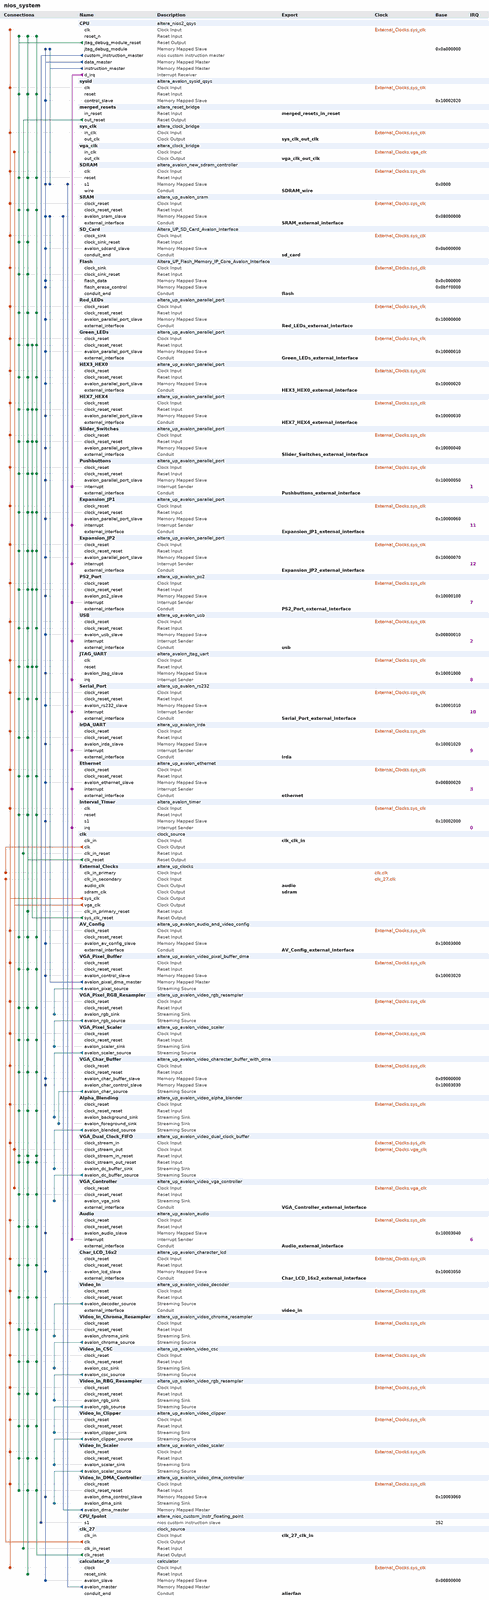
[diagram p0: system contents, whole]
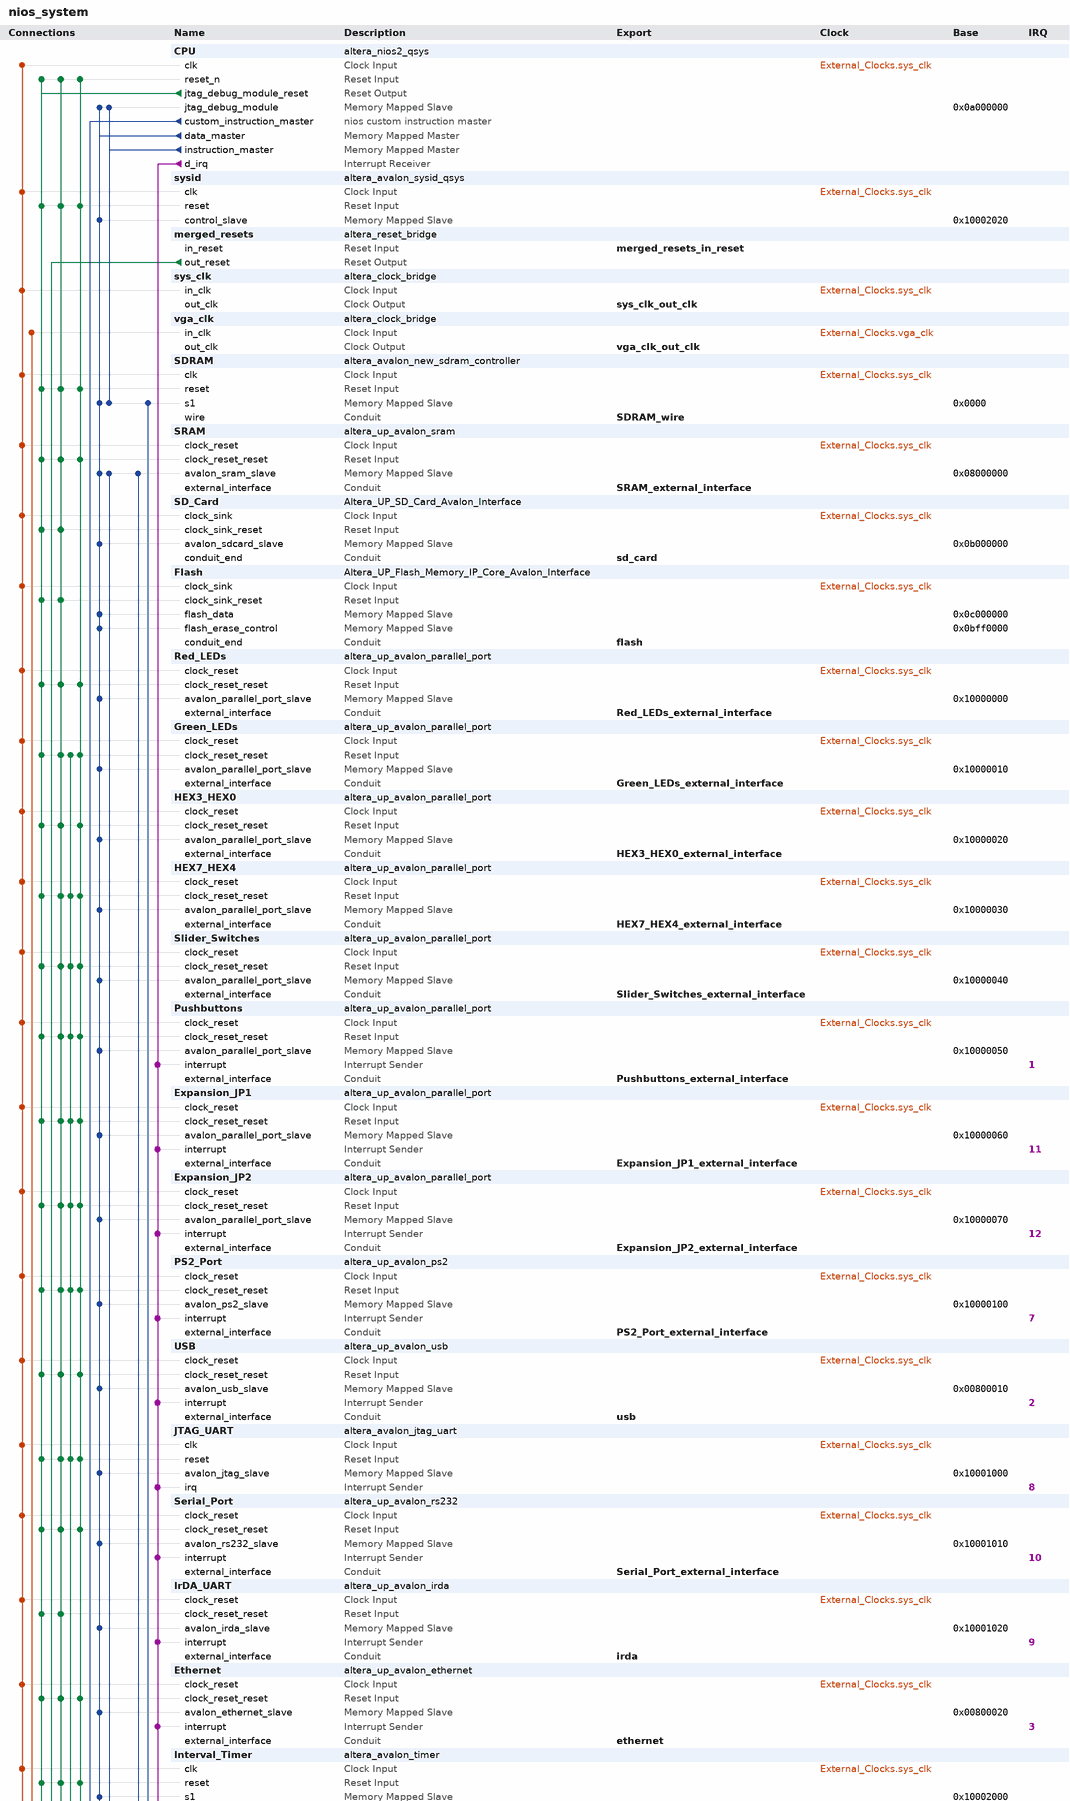
[diagram p1: system contents, upper part]
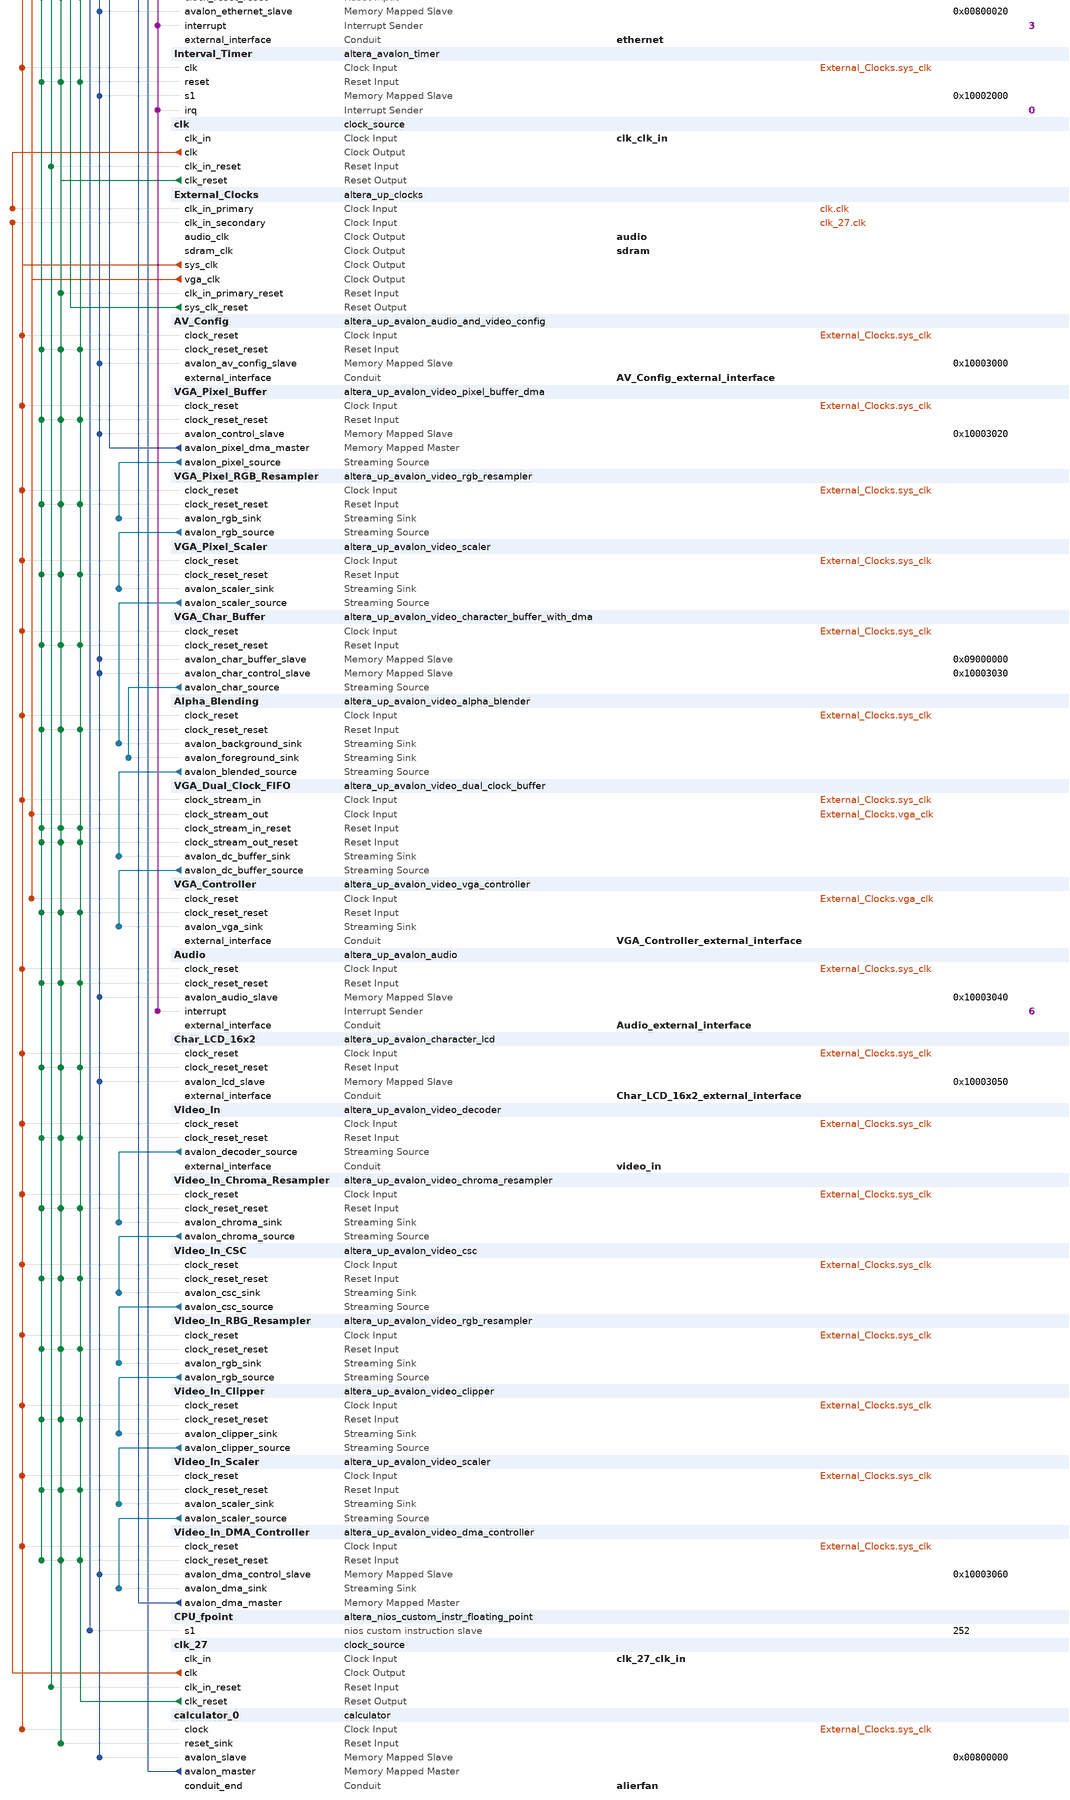
[diagram p2: system contents, lower part]
# Platform Designer (Qsys) system nios_system, Cyclone II EP2C35F672C6
# Parameters at their usual value, and those the tool derives, are not listed.
package require -exact qsys 13.0
create_system nios_system
set_project_property DEVICE_FAMILY {Cyclone II}
set_project_property DEVICE EP2C35F672C6

add_instance CPU altera_nios2_qsys 13.0
set_instance_parameter_value CPU muldiv_divider true
set_instance_parameter_value CPU resetSlave SDRAM.s1
set_instance_parameter_value CPU exceptionSlave SDRAM.s1
set_instance_parameter_value CPU breakSlave CPU.jtag_debug_module
set_instance_parameter_value CPU mmu_processIDNumBits 10
set_instance_parameter_value CPU impl Fast
set_instance_parameter_value CPU icache_size 4096
set_instance_parameter_value CPU debug_level Level3
set_instance_parameter_value CPU dcache_size 0
set_instance_parameter_value CPU dcache_lineSize 4

add_instance sysid altera_avalon_sysid_qsys 13.0
set_instance_parameter_value sysid id 0

add_instance merged_resets altera_reset_bridge 13.0
set_instance_parameter_value merged_resets ACTIVE_LOW_RESET 1
set_instance_parameter_value merged_resets SYNCHRONOUS_EDGES none

add_instance sys_clk altera_clock_bridge 13.0
set_instance_parameter_value sys_clk DERIVED_CLOCK_RATE 50000000
set_instance_parameter_value sys_clk EXPLICIT_CLOCK_RATE 0

add_instance vga_clk altera_clock_bridge 13.0
set_instance_parameter_value vga_clk DERIVED_CLOCK_RATE 25000000
set_instance_parameter_value vga_clk EXPLICIT_CLOCK_RATE 0

add_instance SDRAM altera_avalon_new_sdram_controller 13.0.1.99.2
set_instance_parameter_value SDRAM TAC 5.5
set_instance_parameter_value SDRAM TRCD 20.0
set_instance_parameter_value SDRAM TRP 20.0
set_instance_parameter_value SDRAM casLatency 3
set_instance_parameter_value SDRAM columnWidth 8
set_instance_parameter_value SDRAM dataWidth 16
set_instance_parameter_value SDRAM generateSimulationModel false
set_instance_parameter_value SDRAM model custom
set_instance_parameter_value SDRAM numberOfBanks 4
set_instance_parameter_value SDRAM numberOfChipSelects 1
set_instance_parameter_value SDRAM powerUpDelay 100.0
set_instance_parameter_value SDRAM refreshPeriod 15.625
set_instance_parameter_value SDRAM rowWidth 12

add_instance SRAM altera_up_avalon_sram 13.0
set_instance_parameter_value SRAM board DE2
set_instance_parameter_value SRAM pixel_buffer true

add_instance SD_Card Altera_UP_SD_Card_Avalon_Interface 13.0

add_instance Flash Altera_UP_Flash_Memory_IP_Core_Avalon_Interface 13.0
set_instance_parameter_value Flash FLASH_MEMORY_ADDRESS_WIDTH 22

add_instance Red_LEDs altera_up_avalon_parallel_port 13.0
set_instance_parameter_value Red_LEDs board DE2
set_instance_parameter_value Red_LEDs preset LEDs
set_instance_parameter_value Red_LEDs leds Red
set_instance_parameter_value Red_LEDs capture false
set_instance_parameter_value Red_LEDs edge Rising
set_instance_parameter_value Red_LEDs irq false

add_instance Green_LEDs altera_up_avalon_parallel_port 13.0
set_instance_parameter_value Green_LEDs board DE2
set_instance_parameter_value Green_LEDs preset LEDs
set_instance_parameter_value Green_LEDs capture false
set_instance_parameter_value Green_LEDs edge Rising
set_instance_parameter_value Green_LEDs irq false

add_instance HEX3_HEX0 altera_up_avalon_parallel_port 13.0
set_instance_parameter_value HEX3_HEX0 board DE2
set_instance_parameter_value HEX3_HEX0 preset {Seven Segment Displays}
set_instance_parameter_value HEX3_HEX0 capture false
set_instance_parameter_value HEX3_HEX0 edge Rising
set_instance_parameter_value HEX3_HEX0 irq false

add_instance HEX7_HEX4 altera_up_avalon_parallel_port 13.0
set_instance_parameter_value HEX7_HEX4 board DE2
set_instance_parameter_value HEX7_HEX4 preset {Seven Segment Displays}
set_instance_parameter_value HEX7_HEX4 sevensegs {7 to 4}
set_instance_parameter_value HEX7_HEX4 capture false
set_instance_parameter_value HEX7_HEX4 edge Rising
set_instance_parameter_value HEX7_HEX4 irq false

add_instance Slider_Switches altera_up_avalon_parallel_port 13.0
set_instance_parameter_value Slider_Switches board DE2
set_instance_parameter_value Slider_Switches preset {Slider Switches}
set_instance_parameter_value Slider_Switches capture false
set_instance_parameter_value Slider_Switches edge Rising
set_instance_parameter_value Slider_Switches irq false

add_instance Pushbuttons altera_up_avalon_parallel_port 13.0
set_instance_parameter_value Pushbuttons board DE2
set_instance_parameter_value Pushbuttons preset Pushbuttons
set_instance_parameter_value Pushbuttons capture true
set_instance_parameter_value Pushbuttons edge Falling
set_instance_parameter_value Pushbuttons irq true

add_instance Expansion_JP1 altera_up_avalon_parallel_port 13.0
set_instance_parameter_value Expansion_JP1 board DE2
set_instance_parameter_value Expansion_JP1 preset {Expansion Header}
set_instance_parameter_value Expansion_JP1 capture true
set_instance_parameter_value Expansion_JP1 edge Falling
set_instance_parameter_value Expansion_JP1 irq true

add_instance Expansion_JP2 altera_up_avalon_parallel_port 13.0
set_instance_parameter_value Expansion_JP2 board DE2
set_instance_parameter_value Expansion_JP2 preset {Expansion Header}
set_instance_parameter_value Expansion_JP2 gpio {GPIO 1 (JP2)}
set_instance_parameter_value Expansion_JP2 capture true
set_instance_parameter_value Expansion_JP2 edge Falling
set_instance_parameter_value Expansion_JP2 irq true

add_instance PS2_Port altera_up_avalon_ps2 13.0

add_instance USB altera_up_avalon_usb 13.0

add_instance JTAG_UART altera_avalon_jtag_uart 13.0.1.99.2
set_instance_parameter_value JTAG_UART simInteractiveOptions INTERACTIVE_ASCII_OUTPUT

add_instance Serial_Port altera_up_avalon_rs232 13.0
set_instance_parameter_value Serial_Port baud 115200
set_instance_parameter_value Serial_Port parity Odd

add_instance IrDA_UART altera_up_avalon_irda 13.0
set_instance_parameter_value IrDA_UART clk_rate 50000000
set_instance_parameter_value IrDA_UART baud 115200
set_instance_parameter_value IrDA_UART parity None

add_instance Ethernet altera_up_avalon_ethernet 13.0

add_instance Interval_Timer altera_avalon_timer 13.0.1.99.2
set_instance_parameter_value Interval_Timer period 125.0
set_instance_parameter_value Interval_Timer periodUnits MSEC

add_instance clk clock_source 13.0
set_instance_parameter_value clk clockFrequency 50000000

add_instance External_Clocks altera_up_clocks 13.0
set_instance_parameter_value External_Clocks board DE2
set_instance_parameter_value External_Clocks vga_clk true
set_instance_parameter_value External_Clocks audio_clk true
set_instance_parameter_value External_Clocks audio_clk_freq 12.288

add_instance AV_Config altera_up_avalon_audio_and_video_config 13.0
set_instance_parameter_value AV_Config board DE2
set_instance_parameter_value AV_Config audio_in {Microphone to ADC}
set_instance_parameter_value AV_Config line_in_bypass true
set_instance_parameter_value AV_Config bit_length 32
set_instance_parameter_value AV_Config sampling_rate {48 kHz}

add_instance VGA_Pixel_Buffer altera_up_avalon_video_pixel_buffer_dma 13.0
set_instance_parameter_value VGA_Pixel_Buffer addr_mode X-Y
set_instance_parameter_value VGA_Pixel_Buffer start_address 134217728
set_instance_parameter_value VGA_Pixel_Buffer back_start_address 134217728
set_instance_parameter_value VGA_Pixel_Buffer image_width 320
set_instance_parameter_value VGA_Pixel_Buffer image_height 240
set_instance_parameter_value VGA_Pixel_Buffer color_space {16-bit RGB}

add_instance VGA_Pixel_RGB_Resampler altera_up_avalon_video_rgb_resampler 13.0
set_instance_parameter_value VGA_Pixel_RGB_Resampler input_type {16-bit RGB}
set_instance_parameter_value VGA_Pixel_RGB_Resampler output_type {30-bit RGB}
set_instance_parameter_value VGA_Pixel_RGB_Resampler alpha 255

add_instance VGA_Pixel_Scaler altera_up_avalon_video_scaler 13.0
set_instance_parameter_value VGA_Pixel_Scaler width_scaling 2
set_instance_parameter_value VGA_Pixel_Scaler height_scaling 2
set_instance_parameter_value VGA_Pixel_Scaler width_in 320
set_instance_parameter_value VGA_Pixel_Scaler color_bits 10
set_instance_parameter_value VGA_Pixel_Scaler color_planes 3

add_instance VGA_Char_Buffer altera_up_avalon_video_character_buffer_with_dma 13.0
set_instance_parameter_value VGA_Char_Buffer enable_transparency true

add_instance Alpha_Blending altera_up_avalon_video_alpha_blender 13.0

add_instance VGA_Dual_Clock_FIFO altera_up_avalon_video_dual_clock_buffer 13.0
set_instance_parameter_value VGA_Dual_Clock_FIFO color_bits 10

add_instance VGA_Controller altera_up_avalon_video_vga_controller 13.0
set_instance_parameter_value VGA_Controller board DE2

add_instance Audio altera_up_avalon_audio 13.0
set_instance_parameter_value Audio avalon_bus_type {Memory Mapped}
set_instance_parameter_value Audio audio_in true
set_instance_parameter_value Audio dw 32

add_instance Char_LCD_16x2 altera_up_avalon_character_lcd 13.0
set_instance_parameter_value Char_LCD_16x2 cursor Both

add_instance Video_In altera_up_avalon_video_decoder 13.0

add_instance Video_In_Chroma_Resampler altera_up_avalon_video_chroma_resampler 13.0

add_instance Video_In_CSC altera_up_avalon_video_csc 13.0

add_instance Video_In_RBG_Resampler altera_up_avalon_video_rgb_resampler 13.0
set_instance_parameter_value Video_In_RBG_Resampler input_type {24-bit RGB}
set_instance_parameter_value Video_In_RBG_Resampler output_type {16-bit RGB}
set_instance_parameter_value Video_In_RBG_Resampler alpha 1023

add_instance Video_In_Clipper altera_up_avalon_video_clipper 13.0
set_instance_parameter_value Video_In_Clipper color_bits 16
set_instance_parameter_value Video_In_Clipper color_planes 1

add_instance Video_In_Scaler altera_up_avalon_video_scaler 13.0
set_instance_parameter_value Video_In_Scaler width_scaling 0.5
set_instance_parameter_value Video_In_Scaler height_scaling 1
set_instance_parameter_value Video_In_Scaler width_in 640
set_instance_parameter_value Video_In_Scaler color_bits 16
set_instance_parameter_value Video_In_Scaler color_planes 1

add_instance Video_In_DMA_Controller altera_up_avalon_video_dma_controller 13.0
set_instance_parameter_value Video_In_DMA_Controller mode {From Stream to Memory}
set_instance_parameter_value Video_In_DMA_Controller addr_mode X-Y
set_instance_parameter_value Video_In_DMA_Controller start_address 134217728
set_instance_parameter_value Video_In_DMA_Controller back_start_address 134217728
set_instance_parameter_value Video_In_DMA_Controller width 320
set_instance_parameter_value Video_In_DMA_Controller height 240
set_instance_parameter_value Video_In_DMA_Controller color_bits 16
set_instance_parameter_value Video_In_DMA_Controller color_planes 1
set_instance_parameter_value Video_In_DMA_Controller dma_enabled false

add_instance CPU_fpoint altera_nios_custom_instr_floating_point 13.0

add_instance clk_27 clock_source 13.0
set_instance_parameter_value clk_27 clockFrequency 27000000

add_instance calculator_0 calculator 1.0

# connections
add_connection clk.clk External_Clocks.clk_in_primary clock
add_connection clk_27.clk External_Clocks.clk_in_secondary clock
add_connection External_Clocks.sys_clk Alpha_Blending.clock_reset clock
add_connection External_Clocks.sys_clk Audio.clock_reset clock
add_connection External_Clocks.sys_clk AV_Config.clock_reset clock
add_connection External_Clocks.sys_clk calculator_0.clock clock
add_connection External_Clocks.sys_clk Char_LCD_16x2.clock_reset clock
add_connection External_Clocks.sys_clk CPU.clk clock
add_connection External_Clocks.sys_clk Ethernet.clock_reset clock
add_connection External_Clocks.sys_clk Expansion_JP1.clock_reset clock
add_connection External_Clocks.sys_clk Expansion_JP2.clock_reset clock
add_connection External_Clocks.sys_clk Flash.clock_sink clock
add_connection External_Clocks.sys_clk Green_LEDs.clock_reset clock
add_connection External_Clocks.sys_clk HEX3_HEX0.clock_reset clock
add_connection External_Clocks.sys_clk HEX7_HEX4.clock_reset clock
add_connection External_Clocks.sys_clk Interval_Timer.clk clock
add_connection External_Clocks.sys_clk IrDA_UART.clock_reset clock
add_connection External_Clocks.sys_clk JTAG_UART.clk clock
add_connection External_Clocks.sys_clk PS2_Port.clock_reset clock
add_connection External_Clocks.sys_clk Pushbuttons.clock_reset clock
add_connection External_Clocks.sys_clk Red_LEDs.clock_reset clock
add_connection External_Clocks.sys_clk SD_Card.clock_sink clock
add_connection External_Clocks.sys_clk SDRAM.clk clock
add_connection External_Clocks.sys_clk Serial_Port.clock_reset clock
add_connection External_Clocks.sys_clk Slider_Switches.clock_reset clock
add_connection External_Clocks.sys_clk SRAM.clock_reset clock
add_connection External_Clocks.sys_clk sys_clk.in_clk clock
add_connection External_Clocks.sys_clk sysid.clk clock
add_connection External_Clocks.sys_clk USB.clock_reset clock
add_connection External_Clocks.sys_clk VGA_Char_Buffer.clock_reset clock
add_connection External_Clocks.sys_clk VGA_Dual_Clock_FIFO.clock_stream_in clock
add_connection External_Clocks.sys_clk VGA_Pixel_Buffer.clock_reset clock
add_connection External_Clocks.sys_clk VGA_Pixel_RGB_Resampler.clock_reset clock
add_connection External_Clocks.sys_clk VGA_Pixel_Scaler.clock_reset clock
add_connection External_Clocks.sys_clk Video_In.clock_reset clock
add_connection External_Clocks.sys_clk Video_In_Chroma_Resampler.clock_reset clock
add_connection External_Clocks.sys_clk Video_In_Clipper.clock_reset clock
add_connection External_Clocks.sys_clk Video_In_CSC.clock_reset clock
add_connection External_Clocks.sys_clk Video_In_DMA_Controller.clock_reset clock
add_connection External_Clocks.sys_clk Video_In_RBG_Resampler.clock_reset clock
add_connection External_Clocks.sys_clk Video_In_Scaler.clock_reset clock
add_connection External_Clocks.vga_clk vga_clk.in_clk clock
add_connection External_Clocks.vga_clk VGA_Controller.clock_reset clock
add_connection External_Clocks.vga_clk VGA_Dual_Clock_FIFO.clock_stream_out clock
add_connection clk.clk_reset Alpha_Blending.clock_reset_reset reset
add_connection clk.clk_reset Audio.clock_reset_reset reset
add_connection clk.clk_reset AV_Config.clock_reset_reset reset
add_connection clk.clk_reset calculator_0.reset_sink reset
add_connection clk.clk_reset Char_LCD_16x2.clock_reset_reset reset
add_connection clk.clk_reset CPU.reset_n reset
add_connection clk.clk_reset Ethernet.clock_reset_reset reset
add_connection clk.clk_reset Expansion_JP1.clock_reset_reset reset
add_connection clk.clk_reset Expansion_JP2.clock_reset_reset reset
add_connection clk.clk_reset External_Clocks.clk_in_primary_reset reset
add_connection clk.clk_reset Flash.clock_sink_reset reset
add_connection clk.clk_reset Green_LEDs.clock_reset_reset reset
add_connection clk.clk_reset HEX3_HEX0.clock_reset_reset reset
add_connection clk.clk_reset HEX7_HEX4.clock_reset_reset reset
add_connection clk.clk_reset Interval_Timer.reset reset
add_connection clk.clk_reset IrDA_UART.clock_reset_reset reset
add_connection clk.clk_reset JTAG_UART.reset reset
add_connection clk.clk_reset PS2_Port.clock_reset_reset reset
add_connection clk.clk_reset Pushbuttons.clock_reset_reset reset
add_connection clk.clk_reset Red_LEDs.clock_reset_reset reset
add_connection clk.clk_reset SD_Card.clock_sink_reset reset
add_connection clk.clk_reset SDRAM.reset reset
add_connection clk.clk_reset Serial_Port.clock_reset_reset reset
add_connection clk.clk_reset Slider_Switches.clock_reset_reset reset
add_connection clk.clk_reset SRAM.clock_reset_reset reset
add_connection clk.clk_reset sysid.reset reset
add_connection clk.clk_reset USB.clock_reset_reset reset
add_connection clk.clk_reset VGA_Char_Buffer.clock_reset_reset reset
add_connection clk.clk_reset VGA_Controller.clock_reset_reset reset
add_connection clk.clk_reset VGA_Dual_Clock_FIFO.clock_stream_in_reset reset
add_connection clk.clk_reset VGA_Dual_Clock_FIFO.clock_stream_out_reset reset
add_connection clk.clk_reset VGA_Pixel_Buffer.clock_reset_reset reset
add_connection clk.clk_reset VGA_Pixel_RGB_Resampler.clock_reset_reset reset
add_connection clk.clk_reset VGA_Pixel_Scaler.clock_reset_reset reset
add_connection clk.clk_reset Video_In.clock_reset_reset reset
add_connection clk.clk_reset Video_In_Chroma_Resampler.clock_reset_reset reset
add_connection clk.clk_reset Video_In_Clipper.clock_reset_reset reset
add_connection clk.clk_reset Video_In_CSC.clock_reset_reset reset
add_connection clk.clk_reset Video_In_DMA_Controller.clock_reset_reset reset
add_connection clk.clk_reset Video_In_RBG_Resampler.clock_reset_reset reset
add_connection clk.clk_reset Video_In_Scaler.clock_reset_reset reset
add_connection clk_27.clk_reset Alpha_Blending.clock_reset_reset reset
add_connection clk_27.clk_reset Audio.clock_reset_reset reset
add_connection clk_27.clk_reset AV_Config.clock_reset_reset reset
add_connection clk_27.clk_reset Char_LCD_16x2.clock_reset_reset reset
add_connection clk_27.clk_reset CPU.reset_n reset
add_connection clk_27.clk_reset Ethernet.clock_reset_reset reset
add_connection clk_27.clk_reset Expansion_JP1.clock_reset_reset reset
add_connection clk_27.clk_reset Expansion_JP2.clock_reset_reset reset
add_connection clk_27.clk_reset Green_LEDs.clock_reset_reset reset
add_connection clk_27.clk_reset HEX3_HEX0.clock_reset_reset reset
add_connection clk_27.clk_reset HEX7_HEX4.clock_reset_reset reset
add_connection clk_27.clk_reset Interval_Timer.reset reset
add_connection clk_27.clk_reset JTAG_UART.reset reset
add_connection clk_27.clk_reset PS2_Port.clock_reset_reset reset
add_connection clk_27.clk_reset Pushbuttons.clock_reset_reset reset
add_connection clk_27.clk_reset Red_LEDs.clock_reset_reset reset
add_connection clk_27.clk_reset SDRAM.reset reset
add_connection clk_27.clk_reset Serial_Port.clock_reset_reset reset
add_connection clk_27.clk_reset Slider_Switches.clock_reset_reset reset
add_connection clk_27.clk_reset SRAM.clock_reset_reset reset
add_connection clk_27.clk_reset sysid.reset reset
add_connection clk_27.clk_reset USB.clock_reset_reset reset
add_connection clk_27.clk_reset VGA_Char_Buffer.clock_reset_reset reset
add_connection clk_27.clk_reset VGA_Controller.clock_reset_reset reset
add_connection clk_27.clk_reset VGA_Dual_Clock_FIFO.clock_stream_in_reset reset
add_connection clk_27.clk_reset VGA_Dual_Clock_FIFO.clock_stream_out_reset reset
add_connection clk_27.clk_reset VGA_Pixel_Buffer.clock_reset_reset reset
add_connection clk_27.clk_reset VGA_Pixel_RGB_Resampler.clock_reset_reset reset
add_connection clk_27.clk_reset VGA_Pixel_Scaler.clock_reset_reset reset
add_connection clk_27.clk_reset Video_In.clock_reset_reset reset
add_connection clk_27.clk_reset Video_In_Chroma_Resampler.clock_reset_reset reset
add_connection clk_27.clk_reset Video_In_Clipper.clock_reset_reset reset
add_connection clk_27.clk_reset Video_In_CSC.clock_reset_reset reset
add_connection clk_27.clk_reset Video_In_DMA_Controller.clock_reset_reset reset
add_connection clk_27.clk_reset Video_In_RBG_Resampler.clock_reset_reset reset
add_connection clk_27.clk_reset Video_In_Scaler.clock_reset_reset reset
add_connection CPU.jtag_debug_module_reset Alpha_Blending.clock_reset_reset reset
add_connection CPU.jtag_debug_module_reset Audio.clock_reset_reset reset
add_connection CPU.jtag_debug_module_reset AV_Config.clock_reset_reset reset
add_connection CPU.jtag_debug_module_reset Char_LCD_16x2.clock_reset_reset reset
add_connection CPU.jtag_debug_module_reset CPU.reset_n reset
add_connection CPU.jtag_debug_module_reset Ethernet.clock_reset_reset reset
add_connection CPU.jtag_debug_module_reset Expansion_JP1.clock_reset_reset reset
add_connection CPU.jtag_debug_module_reset Expansion_JP2.clock_reset_reset reset
add_connection CPU.jtag_debug_module_reset Flash.clock_sink_reset reset
add_connection CPU.jtag_debug_module_reset Green_LEDs.clock_reset_reset reset
add_connection CPU.jtag_debug_module_reset HEX3_HEX0.clock_reset_reset reset
add_connection CPU.jtag_debug_module_reset HEX7_HEX4.clock_reset_reset reset
add_connection CPU.jtag_debug_module_reset Interval_Timer.reset reset
add_connection CPU.jtag_debug_module_reset IrDA_UART.clock_reset_reset reset
add_connection CPU.jtag_debug_module_reset JTAG_UART.reset reset
add_connection CPU.jtag_debug_module_reset PS2_Port.clock_reset_reset reset
add_connection CPU.jtag_debug_module_reset Pushbuttons.clock_reset_reset reset
add_connection CPU.jtag_debug_module_reset Red_LEDs.clock_reset_reset reset
add_connection CPU.jtag_debug_module_reset SD_Card.clock_sink_reset reset
add_connection CPU.jtag_debug_module_reset SDRAM.reset reset
add_connection CPU.jtag_debug_module_reset Serial_Port.clock_reset_reset reset
add_connection CPU.jtag_debug_module_reset Slider_Switches.clock_reset_reset reset
add_connection CPU.jtag_debug_module_reset SRAM.clock_reset_reset reset
add_connection CPU.jtag_debug_module_reset sysid.reset reset
add_connection CPU.jtag_debug_module_reset USB.clock_reset_reset reset
add_connection CPU.jtag_debug_module_reset VGA_Char_Buffer.clock_reset_reset reset
add_connection CPU.jtag_debug_module_reset VGA_Controller.clock_reset_reset reset
add_connection CPU.jtag_debug_module_reset VGA_Dual_Clock_FIFO.clock_stream_in_reset reset
add_connection CPU.jtag_debug_module_reset VGA_Dual_Clock_FIFO.clock_stream_out_reset reset
add_connection CPU.jtag_debug_module_reset VGA_Pixel_Buffer.clock_reset_reset reset
add_connection CPU.jtag_debug_module_reset VGA_Pixel_RGB_Resampler.clock_reset_reset reset
add_connection CPU.jtag_debug_module_reset VGA_Pixel_Scaler.clock_reset_reset reset
add_connection CPU.jtag_debug_module_reset Video_In.clock_reset_reset reset
add_connection CPU.jtag_debug_module_reset Video_In_Chroma_Resampler.clock_reset_reset reset
add_connection CPU.jtag_debug_module_reset Video_In_Clipper.clock_reset_reset reset
add_connection CPU.jtag_debug_module_reset Video_In_CSC.clock_reset_reset reset
add_connection CPU.jtag_debug_module_reset Video_In_DMA_Controller.clock_reset_reset reset
add_connection CPU.jtag_debug_module_reset Video_In_RBG_Resampler.clock_reset_reset reset
add_connection CPU.jtag_debug_module_reset Video_In_Scaler.clock_reset_reset reset
add_connection External_Clocks.sys_clk_reset Expansion_JP1.clock_reset_reset reset
add_connection External_Clocks.sys_clk_reset Expansion_JP2.clock_reset_reset reset
add_connection External_Clocks.sys_clk_reset Green_LEDs.clock_reset_reset reset
add_connection External_Clocks.sys_clk_reset HEX7_HEX4.clock_reset_reset reset
add_connection External_Clocks.sys_clk_reset JTAG_UART.reset reset
add_connection External_Clocks.sys_clk_reset PS2_Port.clock_reset_reset reset
add_connection External_Clocks.sys_clk_reset Pushbuttons.clock_reset_reset reset
add_connection External_Clocks.sys_clk_reset Slider_Switches.clock_reset_reset reset
add_connection merged_resets.out_reset clk.clk_in_reset reset
add_connection merged_resets.out_reset clk_27.clk_in_reset reset
add_connection calculator_0.avalon_master SDRAM.s1 avalon
set_connection_parameter_value calculator_0.avalon_master/SDRAM.s1 baseAddress 0x0000
add_connection CPU.data_master Audio.avalon_audio_slave avalon
set_connection_parameter_value CPU.data_master/Audio.avalon_audio_slave baseAddress 0x10003040
add_connection CPU.data_master AV_Config.avalon_av_config_slave avalon
set_connection_parameter_value CPU.data_master/AV_Config.avalon_av_config_slave baseAddress 0x10003000
add_connection CPU.data_master calculator_0.avalon_slave avalon
set_connection_parameter_value CPU.data_master/calculator_0.avalon_slave baseAddress 0x00800000
add_connection CPU.data_master Char_LCD_16x2.avalon_lcd_slave avalon
set_connection_parameter_value CPU.data_master/Char_LCD_16x2.avalon_lcd_slave baseAddress 0x10003050
add_connection CPU.data_master CPU.jtag_debug_module avalon
set_connection_parameter_value CPU.data_master/CPU.jtag_debug_module baseAddress 0x0a000000
add_connection CPU.data_master Ethernet.avalon_ethernet_slave avalon
set_connection_parameter_value CPU.data_master/Ethernet.avalon_ethernet_slave baseAddress 0x00800020
add_connection CPU.data_master Expansion_JP1.avalon_parallel_port_slave avalon
set_connection_parameter_value CPU.data_master/Expansion_JP1.avalon_parallel_port_slave baseAddress 0x10000060
add_connection CPU.data_master Expansion_JP2.avalon_parallel_port_slave avalon
set_connection_parameter_value CPU.data_master/Expansion_JP2.avalon_parallel_port_slave baseAddress 0x10000070
add_connection CPU.data_master Flash.flash_data avalon
set_connection_parameter_value CPU.data_master/Flash.flash_data baseAddress 0x0c000000
add_connection CPU.data_master Flash.flash_erase_control avalon
set_connection_parameter_value CPU.data_master/Flash.flash_erase_control baseAddress 0x0bff0000
add_connection CPU.data_master Green_LEDs.avalon_parallel_port_slave avalon
set_connection_parameter_value CPU.data_master/Green_LEDs.avalon_parallel_port_slave baseAddress 0x10000010
add_connection CPU.data_master HEX3_HEX0.avalon_parallel_port_slave avalon
set_connection_parameter_value CPU.data_master/HEX3_HEX0.avalon_parallel_port_slave baseAddress 0x10000020
add_connection CPU.data_master HEX7_HEX4.avalon_parallel_port_slave avalon
set_connection_parameter_value CPU.data_master/HEX7_HEX4.avalon_parallel_port_slave baseAddress 0x10000030
add_connection CPU.data_master Interval_Timer.s1 avalon
set_connection_parameter_value CPU.data_master/Interval_Timer.s1 baseAddress 0x10002000
add_connection CPU.data_master IrDA_UART.avalon_irda_slave avalon
set_connection_parameter_value CPU.data_master/IrDA_UART.avalon_irda_slave baseAddress 0x10001020
add_connection CPU.data_master JTAG_UART.avalon_jtag_slave avalon
set_connection_parameter_value CPU.data_master/JTAG_UART.avalon_jtag_slave baseAddress 0x10001000
add_connection CPU.data_master PS2_Port.avalon_ps2_slave avalon
set_connection_parameter_value CPU.data_master/PS2_Port.avalon_ps2_slave baseAddress 0x10000100
add_connection CPU.data_master Pushbuttons.avalon_parallel_port_slave avalon
set_connection_parameter_value CPU.data_master/Pushbuttons.avalon_parallel_port_slave baseAddress 0x10000050
add_connection CPU.data_master Red_LEDs.avalon_parallel_port_slave avalon
set_connection_parameter_value CPU.data_master/Red_LEDs.avalon_parallel_port_slave baseAddress 0x10000000
add_connection CPU.data_master SD_Card.avalon_sdcard_slave avalon
set_connection_parameter_value CPU.data_master/SD_Card.avalon_sdcard_slave baseAddress 0x0b000000
add_connection CPU.data_master SDRAM.s1 avalon
set_connection_parameter_value CPU.data_master/SDRAM.s1 baseAddress 0x0000
add_connection CPU.data_master Serial_Port.avalon_rs232_slave avalon
set_connection_parameter_value CPU.data_master/Serial_Port.avalon_rs232_slave baseAddress 0x10001010
add_connection CPU.data_master Slider_Switches.avalon_parallel_port_slave avalon
set_connection_parameter_value CPU.data_master/Slider_Switches.avalon_parallel_port_slave baseAddress 0x10000040
add_connection CPU.data_master SRAM.avalon_sram_slave avalon
set_connection_parameter_value CPU.data_master/SRAM.avalon_sram_slave baseAddress 0x08000000
add_connection CPU.data_master sysid.control_slave avalon
set_connection_parameter_value CPU.data_master/sysid.control_slave baseAddress 0x10002020
add_connection CPU.data_master USB.avalon_usb_slave avalon
set_connection_parameter_value CPU.data_master/USB.avalon_usb_slave baseAddress 0x00800010
add_connection CPU.data_master VGA_Char_Buffer.avalon_char_buffer_slave avalon
set_connection_parameter_value CPU.data_master/VGA_Char_Buffer.avalon_char_buffer_slave baseAddress 0x09000000
add_connection CPU.data_master VGA_Char_Buffer.avalon_char_control_slave avalon
set_connection_parameter_value CPU.data_master/VGA_Char_Buffer.avalon_char_control_slave baseAddress 0x10003030
add_connection CPU.data_master VGA_Pixel_Buffer.avalon_control_slave avalon
set_connection_parameter_value CPU.data_master/VGA_Pixel_Buffer.avalon_control_slave baseAddress 0x10003020
add_connection CPU.data_master Video_In_DMA_Controller.avalon_dma_control_slave avalon
set_connection_parameter_value CPU.data_master/Video_In_DMA_Controller.avalon_dma_control_slave baseAddress 0x10003060
add_connection CPU.instruction_master CPU.jtag_debug_module avalon
set_connection_parameter_value CPU.instruction_master/CPU.jtag_debug_module baseAddress 0x0a000000
add_connection CPU.instruction_master SDRAM.s1 avalon
set_connection_parameter_value CPU.instruction_master/SDRAM.s1 baseAddress 0x0000
add_connection VGA_Pixel_Buffer.avalon_pixel_dma_master SRAM.avalon_sram_slave avalon
set_connection_parameter_value VGA_Pixel_Buffer.avalon_pixel_dma_master/SRAM.avalon_sram_slave baseAddress 0x08000000
add_connection Video_In_DMA_Controller.avalon_dma_master SRAM.avalon_sram_slave avalon
set_connection_parameter_value Video_In_DMA_Controller.avalon_dma_master/SRAM.avalon_sram_slave baseAddress 0x08000000
add_connection Alpha_Blending.avalon_blended_source VGA_Dual_Clock_FIFO.avalon_dc_buffer_sink avalon_streaming
add_connection VGA_Char_Buffer.avalon_char_source Alpha_Blending.avalon_foreground_sink avalon_streaming
add_connection VGA_Dual_Clock_FIFO.avalon_dc_buffer_source VGA_Controller.avalon_vga_sink avalon_streaming
add_connection VGA_Pixel_Buffer.avalon_pixel_source VGA_Pixel_RGB_Resampler.avalon_rgb_sink avalon_streaming
add_connection VGA_Pixel_RGB_Resampler.avalon_rgb_source VGA_Pixel_Scaler.avalon_scaler_sink avalon_streaming
add_connection VGA_Pixel_Scaler.avalon_scaler_source Alpha_Blending.avalon_background_sink avalon_streaming
add_connection Video_In.avalon_decoder_source Video_In_Chroma_Resampler.avalon_chroma_sink avalon_streaming
add_connection Video_In_Chroma_Resampler.avalon_chroma_source Video_In_CSC.avalon_csc_sink avalon_streaming
add_connection Video_In_Clipper.avalon_clipper_source Video_In_Scaler.avalon_scaler_sink avalon_streaming
add_connection Video_In_CSC.avalon_csc_source Video_In_RBG_Resampler.avalon_rgb_sink avalon_streaming
add_connection Video_In_RBG_Resampler.avalon_rgb_source Video_In_Clipper.avalon_clipper_sink avalon_streaming
add_connection Video_In_Scaler.avalon_scaler_source Video_In_DMA_Controller.avalon_dma_sink avalon_streaming
add_connection CPU.d_irq Audio.interrupt interrupt
set_connection_parameter_value CPU.d_irq/Audio.interrupt irqNumber 6
add_connection CPU.d_irq Ethernet.interrupt interrupt
set_connection_parameter_value CPU.d_irq/Ethernet.interrupt irqNumber 3
add_connection CPU.d_irq Expansion_JP1.interrupt interrupt
set_connection_parameter_value CPU.d_irq/Expansion_JP1.interrupt irqNumber 11
add_connection CPU.d_irq Expansion_JP2.interrupt interrupt
set_connection_parameter_value CPU.d_irq/Expansion_JP2.interrupt irqNumber 12
add_connection CPU.d_irq Interval_Timer.irq interrupt
set_connection_parameter_value CPU.d_irq/Interval_Timer.irq irqNumber 0
add_connection CPU.d_irq IrDA_UART.interrupt interrupt
set_connection_parameter_value CPU.d_irq/IrDA_UART.interrupt irqNumber 9
add_connection CPU.d_irq JTAG_UART.irq interrupt
set_connection_parameter_value CPU.d_irq/JTAG_UART.irq irqNumber 8
add_connection CPU.d_irq PS2_Port.interrupt interrupt
set_connection_parameter_value CPU.d_irq/PS2_Port.interrupt irqNumber 7
add_connection CPU.d_irq Pushbuttons.interrupt interrupt
set_connection_parameter_value CPU.d_irq/Pushbuttons.interrupt irqNumber 1
add_connection CPU.d_irq Serial_Port.interrupt interrupt
set_connection_parameter_value CPU.d_irq/Serial_Port.interrupt irqNumber 10
add_connection CPU.d_irq USB.interrupt interrupt
set_connection_parameter_value CPU.d_irq/USB.interrupt irqNumber 2
add_connection CPU.custom_instruction_master CPU_fpoint.s1 nios_custom_instruction
set_connection_parameter_value CPU.custom_instruction_master/CPU_fpoint.s1 CIName fpoint_0
set_connection_parameter_value CPU.custom_instruction_master/CPU_fpoint.s1 baseAddress 252

# exported interfaces
add_interface vga_clk_out_clk clock source
set_interface_property vga_clk_out_clk EXPORT_OF vga_clk.out_clk
add_interface HEX7_HEX4_external_interface conduit end
set_interface_property HEX7_HEX4_external_interface EXPORT_OF HEX7_HEX4.external_interface
add_interface VGA_Controller_external_interface conduit end
set_interface_property VGA_Controller_external_interface EXPORT_OF VGA_Controller.external_interface
add_interface SRAM_external_interface conduit end
set_interface_property SRAM_external_interface EXPORT_OF SRAM.external_interface
add_interface Expansion_JP1_external_interface conduit end
set_interface_property Expansion_JP1_external_interface EXPORT_OF Expansion_JP1.external_interface
add_interface Char_LCD_16x2_external_interface conduit end
set_interface_property Char_LCD_16x2_external_interface EXPORT_OF Char_LCD_16x2.external_interface
add_interface sys_clk_out_clk clock source
set_interface_property sys_clk_out_clk EXPORT_OF sys_clk.out_clk
add_interface Serial_Port_external_interface conduit end
set_interface_property Serial_Port_external_interface EXPORT_OF Serial_Port.external_interface
add_interface Audio_external_interface conduit end
set_interface_property Audio_external_interface EXPORT_OF Audio.external_interface
add_interface Red_LEDs_external_interface conduit end
set_interface_property Red_LEDs_external_interface EXPORT_OF Red_LEDs.external_interface
add_interface merged_resets_in_reset reset sink
set_interface_property merged_resets_in_reset EXPORT_OF merged_resets.in_reset
add_interface SDRAM_wire conduit end
set_interface_property SDRAM_wire EXPORT_OF SDRAM.wire
add_interface Green_LEDs_external_interface conduit end
set_interface_property Green_LEDs_external_interface EXPORT_OF Green_LEDs.external_interface
add_interface Slider_Switches_external_interface conduit end
set_interface_property Slider_Switches_external_interface EXPORT_OF Slider_Switches.external_interface
add_interface AV_Config_external_interface conduit end
set_interface_property AV_Config_external_interface EXPORT_OF AV_Config.external_interface
add_interface Expansion_JP2_external_interface conduit end
set_interface_property Expansion_JP2_external_interface EXPORT_OF Expansion_JP2.external_interface
add_interface PS2_Port_external_interface conduit end
set_interface_property PS2_Port_external_interface EXPORT_OF PS2_Port.external_interface
add_interface Pushbuttons_external_interface conduit end
set_interface_property Pushbuttons_external_interface EXPORT_OF Pushbuttons.external_interface
add_interface clk_clk_in clock sink
set_interface_property clk_clk_in EXPORT_OF clk.clk_in
add_interface HEX3_HEX0_external_interface conduit end
set_interface_property HEX3_HEX0_external_interface EXPORT_OF HEX3_HEX0.external_interface
add_interface clk_27_clk_in clock sink
set_interface_property clk_27_clk_in EXPORT_OF clk_27.clk_in
add_interface sdram clock source
set_interface_property sdram EXPORT_OF External_Clocks.sdram_clk
add_interface audio clock source
set_interface_property audio EXPORT_OF External_Clocks.audio_clk
add_interface flash conduit end
set_interface_property flash EXPORT_OF Flash.conduit_end
add_interface sd_card conduit end
set_interface_property sd_card EXPORT_OF SD_Card.conduit_end
add_interface irda conduit end
set_interface_property irda EXPORT_OF IrDA_UART.external_interface
add_interface video_in conduit end
set_interface_property video_in EXPORT_OF Video_In.external_interface
add_interface ethernet conduit end
set_interface_property ethernet EXPORT_OF Ethernet.external_interface
add_interface usb conduit end
set_interface_property usb EXPORT_OF USB.external_interface
add_interface alierfan conduit end
set_interface_property alierfan EXPORT_OF calculator_0.conduit_end

set_interconnect_requirement {$system} qsys_mm.clockCrossingAdapter HANDSHAKE
set_interconnect_requirement {$system} qsys_mm.maxAdditionalLatency 0

save_system nios_system.qsys
